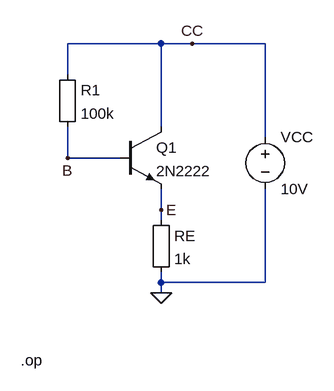
[diagram p0: schematic circuit3a.asc]
circuit3a.asc, the LTspice schematic file:
Version 4
SHEET 1 880 680
WIRE 256 0 112 0
WIRE 304 0 256 0
WIRE 416 0 304 0
WIRE 112 48 112 0
WIRE 256 128 256 0
WIRE 416 144 416 0
WIRE 112 176 112 128
WIRE 192 176 112 176
WIRE 256 256 256 224
WIRE 256 272 256 256
WIRE 256 368 256 352
WIRE 416 368 416 224
WIRE 416 368 256 368
WIRE 256 384 256 368
FLAG 256 384 0
FLAG 112 176 B
FLAG 256 256 E
FLAG 304 0 CC
SYMBOL npn 192 128 R0
SYMATTR InstName Q1
SYMATTR Value 2N2222
SYMBOL Misc\\EuropeanResistor 240 256 R0
SYMATTR InstName RE
SYMATTR Value 1k
SYMBOL Misc\\EuropeanResistor 96 32 R0
SYMATTR InstName R1
SYMATTR Value 100k
SYMBOL voltage 416 128 R0
WINDOW 123 0 0 Left 0
WINDOW 39 0 0 Left 0
SYMATTR InstName VCC
SYMATTR Value 10V
TEXT 40 488 Left 2 !.op

The netlist it stands for:
* circuit3a.asc
Q1 CC B E 0 2N2222
RE E 0 1k
R1 CC B 100k
VCC CC 0 10V
.model NPN NPN
.model PNP PNP
.lib standard.bjt
.op
.backanno
.end